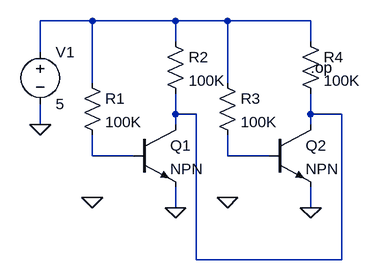
[diagram p0: schematic connect-logic.asc]
connect-logic.asc, the LTspice schematic file:
Version 4
SHEET 1 880 680
WIRE 192 112 112 112
WIRE 320 112 192 112
WIRE 400 112 320 112
WIRE 528 112 400 112
WIRE 320 144 320 112
WIRE 528 144 528 112
WIRE 112 160 112 112
WIRE 192 208 192 112
WIRE 400 208 400 112
WIRE 320 256 320 224
WIRE 352 256 320 256
WIRE 528 256 528 224
WIRE 576 256 528 256
WIRE 112 272 112 240
WIRE 320 272 320 256
WIRE 528 272 528 256
WIRE 192 320 192 288
WIRE 256 320 192 320
WIRE 400 320 400 288
WIRE 464 320 400 320
WIRE 320 400 320 368
WIRE 528 400 528 368
WIRE 352 480 352 256
WIRE 576 480 576 256
WIRE 576 480 352 480
FLAG 112 272 0
FLAG 320 400 0
FLAG 192 384 0
FLAG 528 400 0
FLAG 400 384 0
SYMBOL res 176 192 R0
SYMATTR InstName R1
SYMATTR Value 100K
SYMBOL voltage 112 144 R0
SYMATTR InstName V1
SYMATTR Value 5
SYMBOL npn 256 272 R0
SYMATTR InstName Q1
SYMBOL res 304 128 R0
SYMATTR InstName R2
SYMATTR Value 100K
SYMBOL res 384 192 R0
SYMATTR InstName R3
SYMATTR Value 100K
SYMBOL npn 464 272 R0
SYMATTR InstName Q2
SYMBOL res 512 128 R0
SYMATTR InstName R4
SYMATTR Value 100K
TEXT 528 184 Left 2 !.op

The netlist it stands for:
* connect-logic.asc
R1 N001 N003 100K
V1 N001 0 5
Q1 N002 N003 0 0 NPN
R2 N001 N002 100K
R3 N001 N004 100K
Q2 N002 N004 0 0 NPN
R4 N001 N002 100K
.model NPN NPN
.model PNP PNP
.lib standard.bjt
.op
.backanno
.end